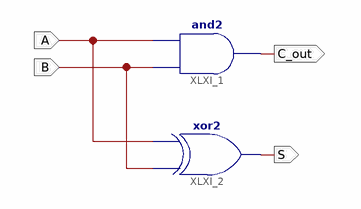
[diagram p0: schematic sheet 1]
// Xilinx ISE schematic CE2_Orner_HA.sch (spartan3e) as structural Verilog: 2 symbols, 4 ports
module CE2_Orner_HA (
  input  B,
  input  A,
  output C_out,
  output S
);

  and XLXI_1 (C_out, B, A);
  xor XLXI_2 (S, B, A);
endmodule
